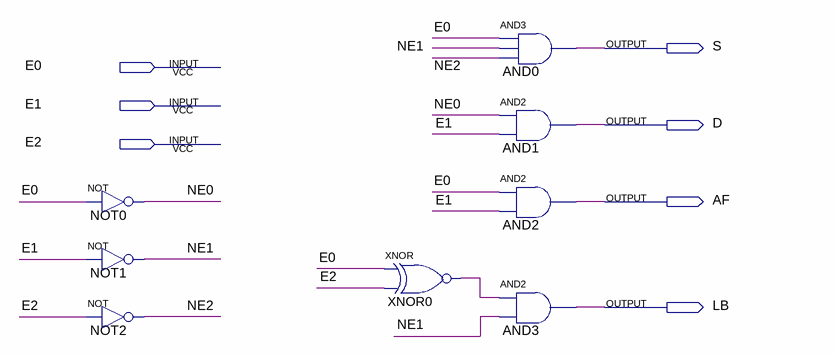
[diagram p0: schematic sheet]
// Quartus schematic LOG_SAIDAS.bdf as structural Verilog: 8 symbols, 7 pins
module LOG_SAIDAS (
  input  E0,
  input  E1,
  input  E2,
  output S,
  output D,
  output AF,
  output LB
);

  wire NE0, NE1, NE2, XNOR0_out;

  not NOT0 (NE0, E0);
  not NOT1 (NE1, E1);
  not NOT2 (NE2, E2);
  xnor XNOR0 (XNOR0_out, E0, E2);
  and AND0 (S, E0, NE1, NE2);
  and AND1 (D, NE0, E1);
  and AND2 (AF, E0, E1);
  and AND3 (LB, XNOR0_out, NE1);
endmodule
